# Altium schematic sheet Provisions.SchDoc
size A4
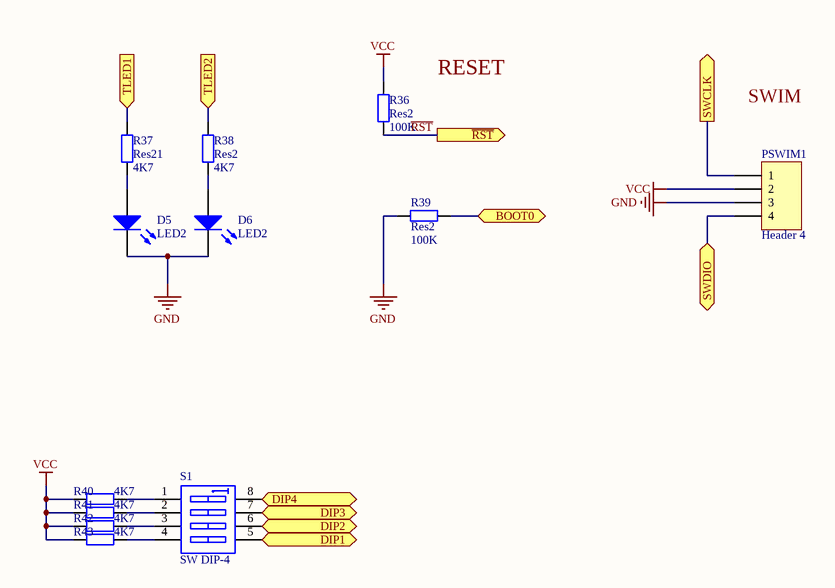
[diagram p0: Provisions.SchDoc]

## Parts
D5  LED2  [3.2X1.6X1.1]
D6  LED2  [3.2X1.6X1.1]
PSWIM1  Header 4  [HDR1X4]
R36  Res2  value 100K  [6-0805_N]
R37  Res21  value 4K7  [6-0805_N]
R38  Res2  value 4K7  [6-0805_N]
R39  Res2  value 100K  [6-0805_N]
R40  value 4K7  [6-0805_N]  (hidden comment: Res2)
R41  value 4K7  [6-0805_N]  (hidden comment: Res2)
R42  value 4K7  [6-0805_N]  (hidden comment: Res2)
R43  value 4K7  [6-0805_N]  (hidden comment: Res2)
S1  SW DIP-4  [SO8_N]

## Ports
BOOT0, DIP1, DIP2, DIP3, DIP4, SWCLK (out), SWDIO, TLED1 (in), TLED2 (in), ~{RST} (out)

## Nets
GND: D5.2(K) D6.2(K) PSWIM1.3 R39.2
VCC: PSWIM1.2 R36.2 R40.2 R41.2 R42.2 R43.2
BOOT0: R39.1 ; port BOOT0
DIP1: S1.5(B4) ; port DIP1
DIP2: S1.6(B3) ; port DIP2
DIP3: S1.7(B2) ; port DIP3
DIP4: S1.8(B1) ; port DIP4
~{RST}: R36.1 ; port ~{RST}
SWCLK: PSWIM1.1 ; port SWCLK
SWDIO: PSWIM1.4 ; port SWDIO
TLED1: R37.2 ; port TLED1
TLED2: R38.2 ; port TLED2
NetD5_1: D5.1(A) R37.1
NetD6_1: D6.1(A) R38.1
NetR40_1: R40.1 S1.1(A1)
NetR41_1: R41.1 S1.2(A2)
NetR42_1: R42.1 S1.3(A3)
NetR43_1: R43.1 S1.4(A4)

## Notes on the sheet
- RESET
- SWIM

## Library data of the parts
D5 D6 = LED2: Typical RED, GREEN, YELLOW, AMBER GaAs LED; Published: 8-Jun-2000; LatestRevisionDate: 17-Jul-2002; LatestRevisionNote: Re-released for DXP Platform.; PackageVersion: Feb-2002; PackageReference: 3.2X1.6X1.1; Publisher: Altium Limited; PackageDescription: SM LED; 2 Flat Leads
  D6: Link: http://voron.ua/catalog/019503; Price: 1.29
PSWIM1 = Header 4: Header, 4-Pin; LatestRevisionDate: 17-Jul-2002; LatestRevisionNote: Re-released for DXP Platform.; Publisher: Altium Limited
R36-R43 = Res2: Resistor; Published: 8-Jun-2000; LatestRevisionDate: 17-Jul-2002; LatestRevisionNote: Re-released for DXP Platform.; PackageReference: AXIAL-0.4; Publisher: Altium Limited; PackageDescription: Axial Device, Thru-Hole; 2 Leads; 0.4 in Pin Spacing
S1 = SW DIP-4: DIP Switch, 4 Position, SPST; Published: 24-Mar-1999; LatestRevisionDate: 29-May-2009; LatestRevisionNote: IPC-7351 Footprint Added.; PackageVersion: Dec-2002; PackageReference: SO8; Publisher: Altium Limited; PackageDescription: 8-Pin Small Outline Integrated Circuit 1.27 mm Pitch; Code_JEDEC: MS-012-AA; Code_IPC: SOIC127P600-8